# Altium schematic sheet Master Diagram.SchDoc
size Letter
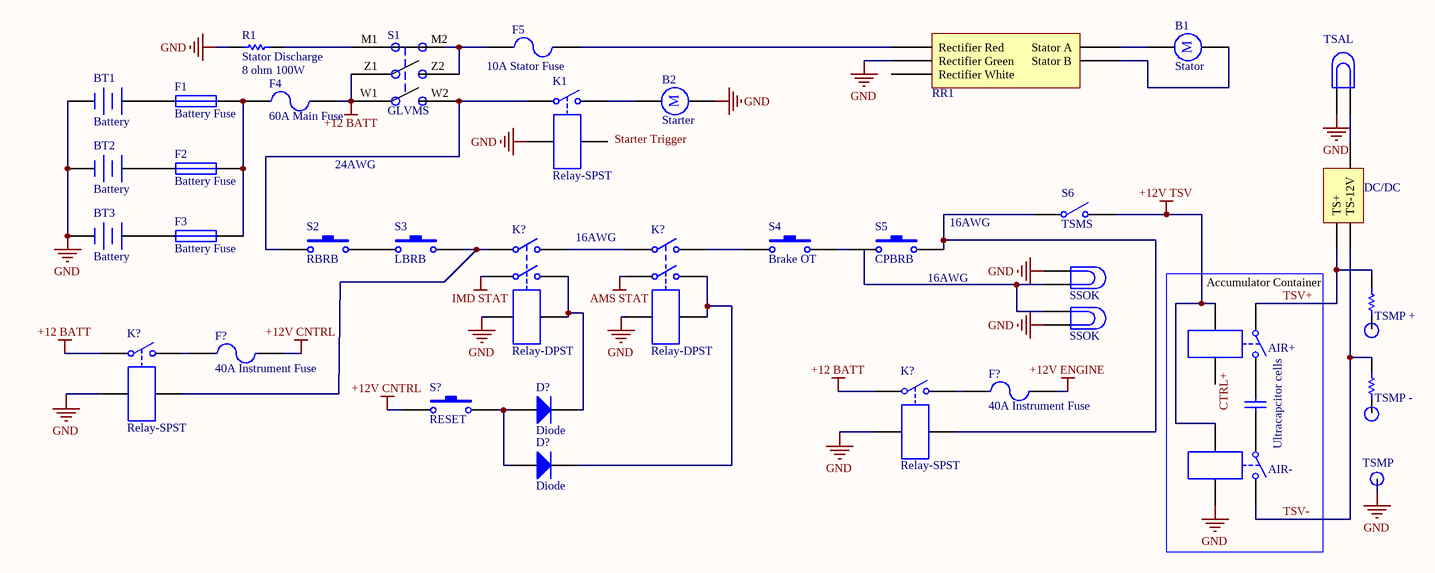
[diagram p0: Master Diagram.SchDoc]

## Parts
(Parts that share a designator on the sheet are numbered #1, #2 ... from top to bottom, then left to right.)
B1  Stator  [RB5-10.5]
B2  Starter  [RB5-10.5]
BT1  Battery  [BAT-2]
BT2  Battery  [BAT-2]
BT3  Battery  [BAT-2]
C1  Ultracapcitor cells  [RAD-0.3]
D?#1  Diode  [SMC]
D?#2  Diode  [SMC]
DS1  SSOK  [PIN2]
DS2  SSOK  [PIN2]
DS3  TSAL  [PIN2]
F1  Battery Fuse  [PIN-W2/E2.8]
F2  Battery Fuse  [PIN-W2/E2.8]
F3  Battery Fuse  [PIN-W2/E2.8]
F4  60A Main Fuse  [PIN-W2/E2.8]
F5  10A Stator Fuse  [PIN-W2/E2.8]
F?#1  40A Instrument Fuse  [PIN-W2/E2.8]
F?#2  40A Instrument Fuse  [PIN-W2/E2.8]
K1  Relay-SPST  [MODULE4]
K3  AIR+  [MODULE4]
K4  AIR-  [MODULE4]
K?#1  Relay-DPST  [MODULE6]
K?#2  Relay-DPST  [MODULE6]
K?#3  Relay-SPST  [MODULE4]
K?#4  Relay-SPST  [MODULE4]
P?  DC/DC  [4Pin Molex]
R1  Stator Discharge  value 8 ohm 100W  [AXIAL-0.3]
R5  Res1  [AXIAL-0.3]  (value not drawn)
R?  Res1  [AXIAL-0.3]  (value not drawn)
RR1  Regulator Rectifier  (value not drawn)
S1  GLVMS
S2  RBRB  [SPST-2]
S3  LBRB  [SPST-2]
S4  Brake OT  [SPST-2]
S5  CPBRB  [SPST-2]
S6  TSMS  [SPST-2]
S?  RESET  [SPST-2]

## Nets
+12 BATT: F4.2 K?#3.1 K?#4.1 S1.W1 S1.Z1
+12V CNTRL: F?#1.1 S?.1
+12V ENGINE: F?#2.1
+12V TSV: K3.3 K4.3 S6.2(NO)
AMS STAT: K?#2.3
GND: B2.2 BT1.2(-) BT2.2(-) BT3.2(-) DS1.1 DS2.2 DS3.2 K1.3 K4.4 K?#1.5 K?#2.5 K?#3.3 K?#4.3 R1.1 RR1.10(Rectifier_Green)
IMD STAT: K?#1.3
TSV+: K3.1 P?.4(TS+) R?.2
TSV-: K4.2 P?.2(TS-) R5.2
NetB1_1: B1.1 RR1.7(Stator_A)
NetB1_2: B1.2 RR1.8(Stator_B)
NetB2_1: B2.1 K1.2
NetBT1_1: BT1.1(+) F1.1
NetBT2_1: BT2.1(+) F2.1
NetBT3_1: BT3.1(+) F3.1
NetC1_1: C1.1 K4.1
NetC1_2: C1.2 K3.2
NetD?#1_1: D?#1.1(A) D?#2.1(A) S?.2
NetD?#1_2: D?#1.2(K) K?#1.4 K?#1.6
NetD?#2_2: D?#2.2(K) K?#2.4 K?#2.6
NetDS1_2: DS1.2 DS2.1
NetDS3_1: DS3.1 P?.1(12V)
NetF1_2: F1.2 F2.2 F3.2 F4.1
NetF5_1: F5.1 S1.M2 S1.Z2
NetF5_2: F5.2 RR1.9(Rectifier_Red)
NetF?#1_2: F?#1.2 K?#3.2
NetF?#2_2: F?#2.2 K?#4.2
NetK1_1: K1.1 S1.W2 S2.1
NetK?#1_1: K?#1.1 K?#3.4 S3.2
NetK?#1_2: K?#1.2 K?#2.1
NetK?#2_2: K?#2.2 S4.1
NetK?#4_4: K?#4.4 S5.2 S6.1(COMMON)
NetR1_2: R1.2 S1.M1
NetS4_2: S4.2 S5.1

Not connected (* = marked no-connect by the designer): K1 4; K3 4; P? 3; R5 1; R? 1; RR1 11(Rectifier_White); S2 2; S3 1

## Notes on the sheet
- 24AWG
- (near K?#1) 16AWG
- (near S5) 16AWG
- (near R?) TSMP +
- TSMP
- (near R5) TSMP -
- Accumulator Container
- Labels drawn without touching a wire or pin: CTRL+, Starter Trigger
- (in symbol Motor) M

## Library data of the parts
B1 B2 = Motor: Motor, General Kind; Published: 24-Mar-1999; LatestRevisionDate: 17-Jul-2002; LatestRevisionNote: Re-released for DXP Platform.; PackageReference: RB5-10.5; Publisher: Altium Limited; PackageDescription: Capacitor (Radial); 2 Leads
BT1-BT3 = Battery: Multicell Battery; Published: 24-Mar-1999; LatestRevisionDate: 17-Jul-2002; LatestRevisionNote: Re-released for DXP Platform.; PackageReference: BAT-2; Publisher: Altium Limited; PackageDescription: Battery; 2 Leads
C1 = Cap: Capacitor; Value: 100pF; Published: 8-Jun-2000; LatestRevisionDate: 17-Jul-2002; LatestRevisionNote: Re-released for DXP Platform.; PackageReference: RAD-0.3; Publisher: Altium Limited; PackageDescription: Radial Cap, Thru-Hole; 2 Leads; 0.3 in Pin Spacing
D?#1 D?#2 = Diode: Default Diode; Published: 8-Jun-2000; LatestRevisionDate: 17-Jul-2002; LatestRevisionNote: Re-released for DXP Platform.; PackageVersion: Sep-1996; PackageReference: SMC; Publisher: Altium Limited; PackageDescription: DO-214-AB/SMC; 2 C-Bend Leads; Body 7.9 x 5.9 mm, inc. leads (LxW); Code_JEDEC: DO-214-AB
DS1-DS3 = Lamp: Incandescent Bulb; Published: 24-Mar-1999; LatestRevisionDate: 17-Jul-2002; LatestRevisionNote: Re-released for DXP Platform.; PackageReference: PIN2; Publisher: Altium Limited
F1-F3 = Fuse 1: Fuse; Published: 8-Jun-2000; LatestRevisionDate: 17-Jul-2002; LatestRevisionNote: Re-released for DXP Platform.; PackageReference: PIN-W2/E2.8; Publisher: Altium Limited; PackageDescription: Thru-Hole; 2 Leads
F4 F5 F?#1 F?#2 = Fuse 2: Fuse; Published: 8-Jun-2000; LatestRevisionDate: 17-Jul-2002; LatestRevisionNote: Re-released for DXP Platform.; PackageReference: PIN-W2/E2.8; Publisher: Altium Limited; PackageDescription: Thru-Hole; 2 Leads
K1 K3 K4 K?#3 K?#4 = Relay-SPST: Single-Pole Single-Throw Relay; Published: 24-Mar-1999; LatestRevisionDate: 17-Jul-2002; LatestRevisionNote: Re-released for DXP Platform.; PackageReference: MODULE4; Publisher: Altium Limited
K?#1 K?#2 = Relay-DPST: Dual-Pole Single-Throw Relay; Published: 24-Mar-1999; LatestRevisionDate: 17-Jul-2002; LatestRevisionNote: Re-released for DXP Platform.; PackageReference: MODULE6; Publisher: Altium Limited
P? = 4Pin Molex: Supplier Part Number: WM3801-ND
R1 = Res1: Resistor; Published: 8-Jun-2000; LatestRevisionDate: 17-Jul-2002; LatestRevisionNote: Re-released for DXP Platform.; PackageReference: AXIAL-0.3; Publisher: Altium Limited; PackageDescription: Axial Device, Thru-Hole; 2 Leads; 0.3 in Pin Spacing
R5 R? = Res1: Resistor; Value: 1K; Published: 8-Jun-2000; LatestRevisionDate: 17-Jul-2002; LatestRevisionNote: Re-released for DXP Platform.; PackageReference: AXIAL-0.3; Publisher: Altium Limited; PackageDescription: Axial Device, Thru-Hole; 2 Leads; 0.3 in Pin Spacing
RR1 = Stator Rectifier
S2-S5 S? = SW-PB: Switch; Published: 24-Mar-1999; LatestRevisionDate: 17-Jul-2002; LatestRevisionNote: Re-released for DXP Platform.; PackageReference: SPST-2; Publisher: Altium Limited; PackageDescription: Switch; 2 Leads
S6 = SW-SPST: Single-Pole, Single-Throw Switch; Published: 24-Mar-1999; LatestRevisionDate: 17-Jul-2002; LatestRevisionNote: Re-released for DXP Platform.; PackageReference: SPST-2; Publisher: Altium Limited; PackageDescription: Switch; 2 Leads